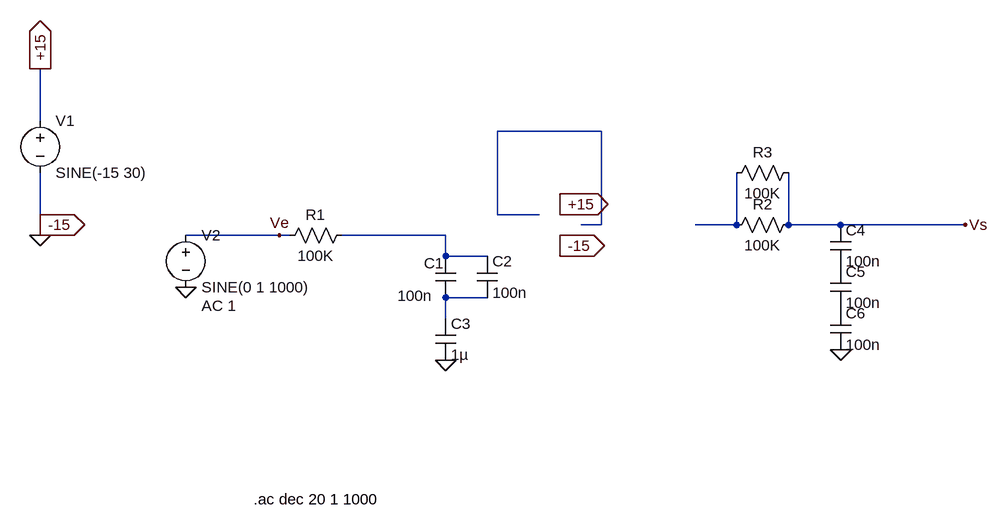
[diagram p0: schematic Draft1.asc]
Draft1.asc, the LTspice schematic file:
Version 4
SHEET 1 880 680
WIRE -624 -112 -624 -192
WIRE 240 -96 80 -96
WIRE 80 32 80 -96
WIRE 144 32 80 32
WIRE -624 48 -624 -32
WIRE 240 48 240 -96
WIRE 240 48 208 48
WIRE 448 48 448 -32
WIRE 448 48 384 48
WIRE 528 48 528 -32
WIRE 608 48 528 48
WIRE 800 48 608 48
WIRE -624 64 -624 48
WIRE -256 64 -400 64
WIRE -240 64 -256 64
WIRE 0 64 -160 64
WIRE 0 96 0 64
WIRE 64 96 0 96
WIRE 64 160 0 160
WIRE 0 192 0 160
FLAG 0 256 0
FLAG -624 -192 +15
IOPIN -624 -192 Out
FLAG 176 16 +15
IOPIN 176 16 Out
FLAG 176 80 -15
IOPIN 176 80 Out
FLAG 608 240 0
FLAG -400 144 0
FLAG 800 48 Vs
FLAG -256 64 Ve
FLAG -624 64 0
FLAG -624 48 -15
IOPIN -624 48 Out
SYMBOL cap -16 96 R0
WINDOW 0 -17 11 Left 2
WINDOW 3 -58 61 Left 2
SYMATTR InstName C1
SYMATTR Value 100n
SYMBOL cap 48 96 R0
SYMATTR InstName C2
SYMATTR Value 100n
SYMBOL cap -16 192 R0
SYMATTR InstName C3
SYMATTR Value 1µ
SYMBOL res -144 48 R90
WINDOW 0 0 56 VBottom 2
WINDOW 3 32 56 VTop 2
SYMATTR InstName R1
SYMATTR Value 100K
SYMBOL voltage -624 -128 R0
WINDOW 123 0 0 Left 0
WINDOW 39 0 0 Left 0
SYMATTR InstName V1
SYMATTR Value SINE(-15 30)
SYMBOL res 544 32 R90
WINDOW 0 0 56 VBottom 2
WINDOW 3 32 56 VTop 2
SYMATTR InstName R2
SYMATTR Value 100K
SYMBOL res 544 -48 R90
WINDOW 0 0 56 VBottom 2
WINDOW 3 32 56 VTop 2
SYMATTR InstName R3
SYMATTR Value 100K
SYMBOL cap 592 48 R0
SYMATTR InstName C4
SYMATTR Value 100n
SYMBOL cap 592 112 R0
SYMATTR InstName C5
SYMATTR Value 100n
SYMBOL cap 592 176 R0
SYMATTR InstName C6
SYMATTR Value 100n
SYMBOL voltage -400 48 R0
WINDOW 123 24 124 Left 2
WINDOW 39 0 0 Left 0
SYMATTR InstName V2
SYMATTR Value SINE(0 1 1000)
SYMATTR Value2 AC 1
TEXT -296 470 Left 2 !.ac dec 20 1 1000

The netlist it stands for:
* Draft1.asc
C1 N003 N004 100n
C2 N003 N004 100n
C3 N004 0 1µ
R1 N003 Ve 100K
V1 +15 0 SINE(-15 30)
R2 Vs N002 100K
R3 Vs N002 100K
C4 Vs P001 100n
C5 P001 P002 100n
C6 P002 0 100n
V2 Ve 0 SINE(0 1 1000) AC 1
.ac dec 20 1 1000
.backanno
.end